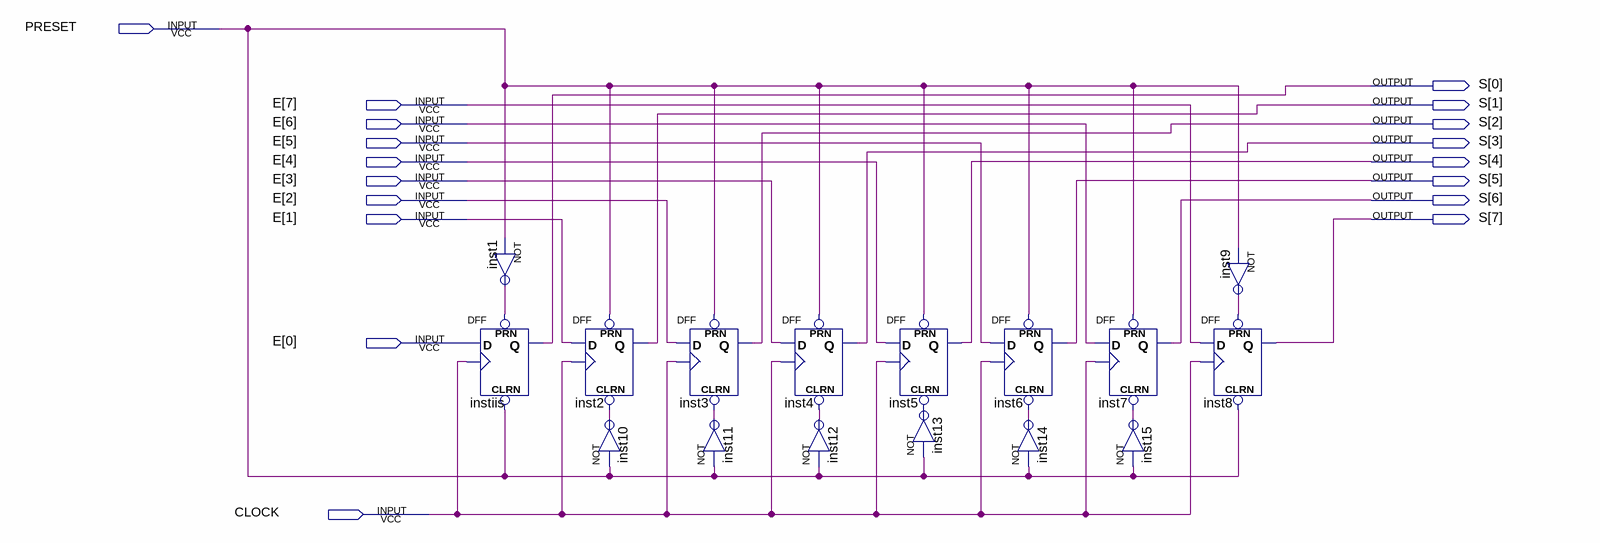
[diagram p0: schematic sheet]
// Quartus schematic linha_1.bdf as structural Verilog: 16 symbols, 18 pins
module linha_1 (
  input  PRESET,
  input  [7:0] E,
  input  CLOCK,
  output [7:0] S
);

  wire inst1_out, inst9_out, inst10_out, inst11_out, inst12_out, inst13_out, inst14_out, inst15_out;

  not inst1 (inst1_out, PRESET);
  DFF instiis (.CLRN(PRESET), .CLK(CLOCK), .D(E[0]), .PRN(inst1_out), .Q(S[0]));
  DFF inst2 (.CLRN(inst10_out), .CLK(CLOCK), .D(E[1]), .PRN(PRESET), .Q(S[1]));
  not inst10 (inst10_out, PRESET);
  DFF inst3 (.CLRN(inst11_out), .CLK(CLOCK), .D(E[2]), .PRN(PRESET), .Q(S[2]));
  not inst11 (inst11_out, PRESET);
  DFF inst4 (.CLRN(inst12_out), .CLK(CLOCK), .D(E[3]), .PRN(PRESET), .Q(S[3]));
  not inst12 (inst12_out, PRESET);
  DFF inst5 (.CLRN(inst13_out), .CLK(CLOCK), .D(E[4]), .PRN(PRESET), .Q(S[4]));
  not inst13 (inst13_out, PRESET);
  DFF inst6 (.CLRN(inst14_out), .CLK(CLOCK), .D(E[5]), .PRN(PRESET), .Q(S[5]));
  not inst14 (inst14_out, PRESET);
  DFF inst7 (.CLRN(inst15_out), .CLK(CLOCK), .D(E[6]), .PRN(PRESET), .Q(S[6]));
  not inst15 (inst15_out, PRESET);
  not inst9 (inst9_out, PRESET);
  DFF inst8 (.CLRN(PRESET), .CLK(CLOCK), .D(E[7]), .PRN(inst9_out), .Q(S[7]));
endmodule
